# EAGLE design UGVboard (EAGLE 6.2)
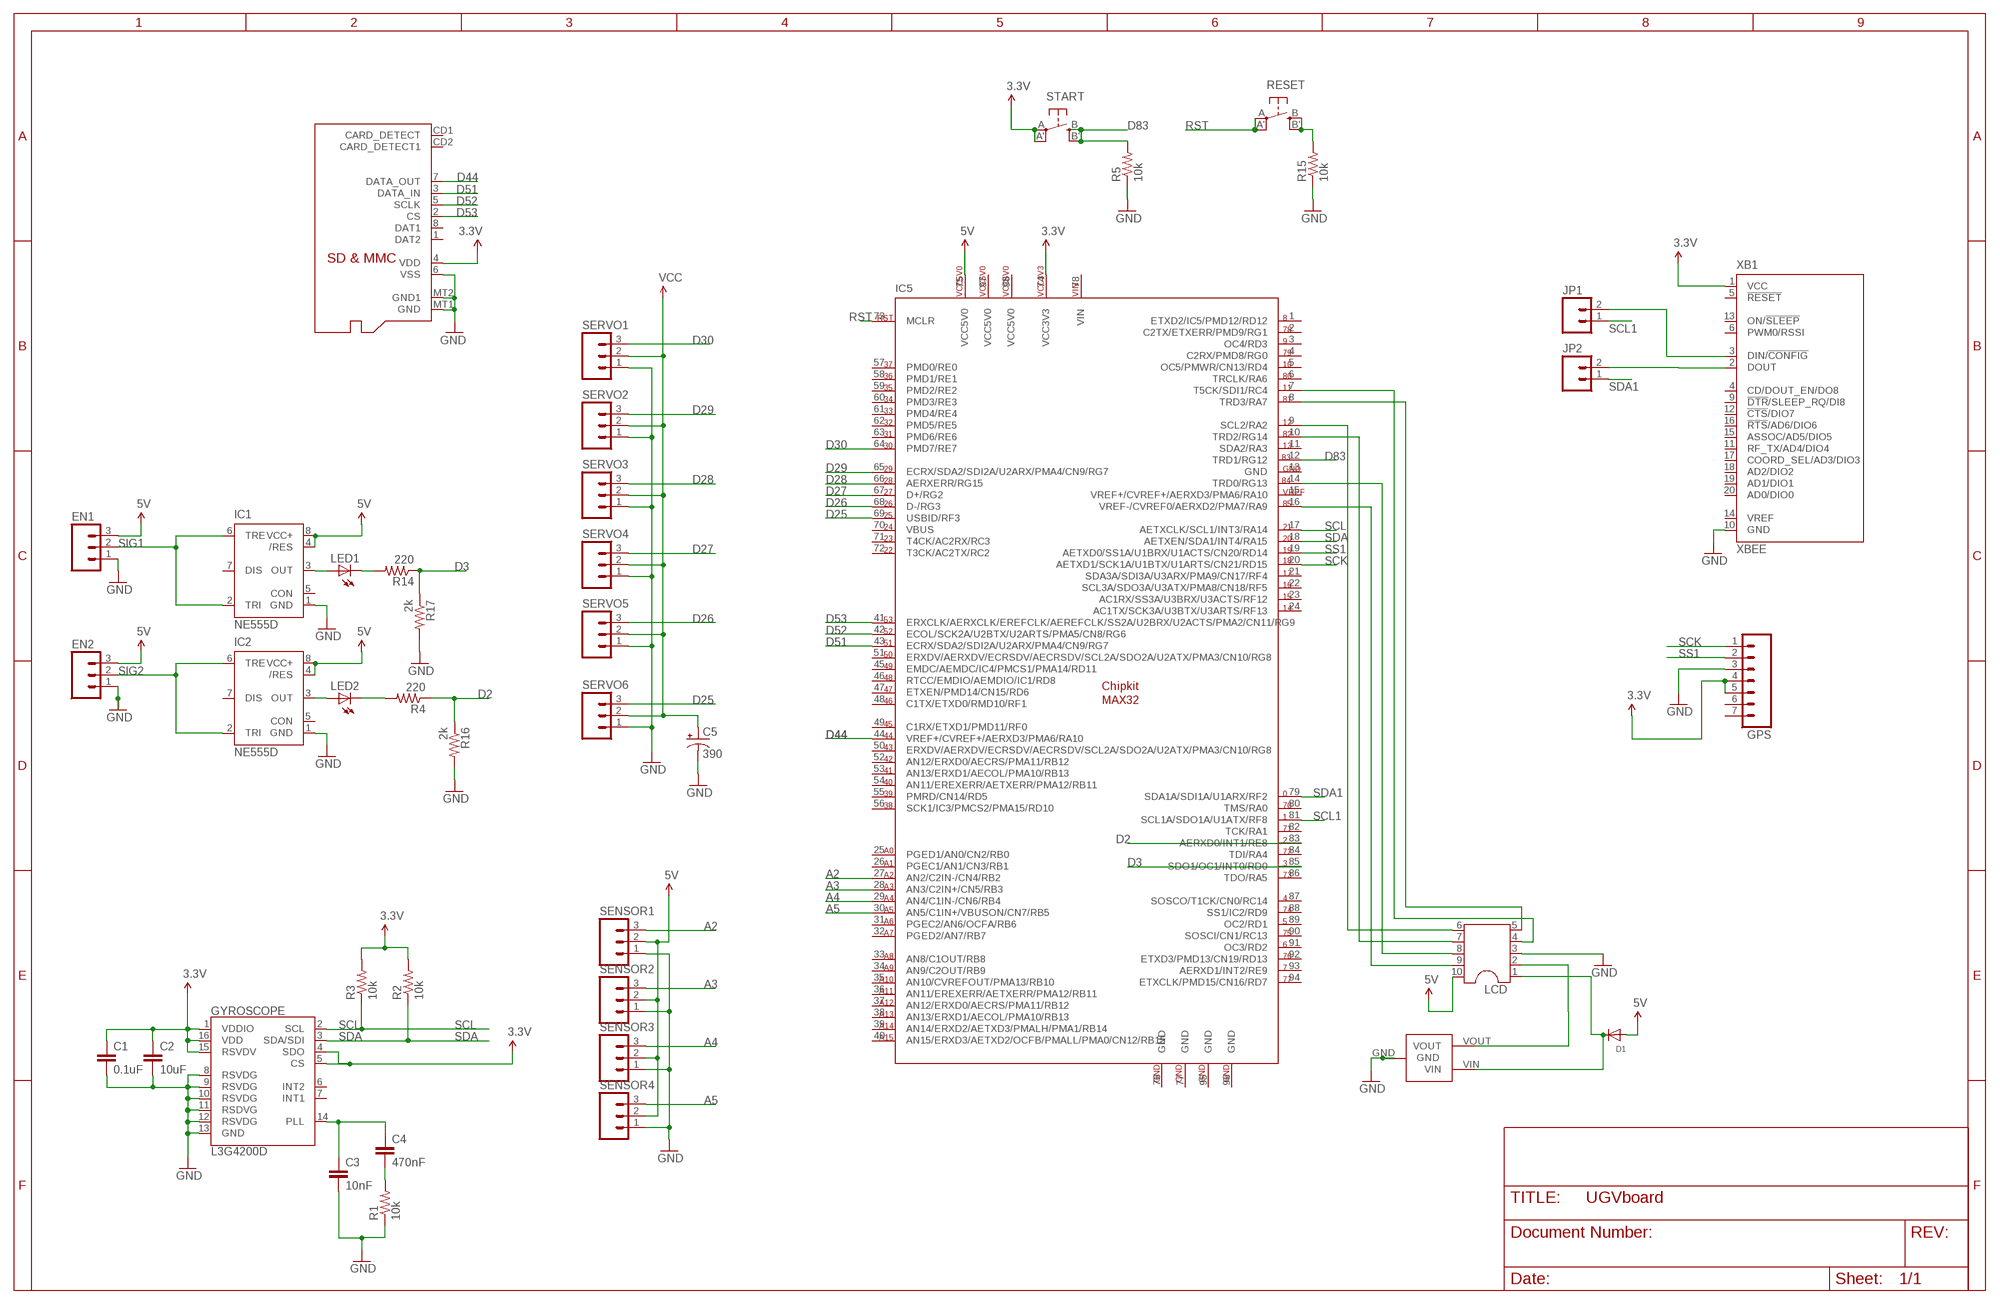
[diagram p0: schematic, sheet 1]

## Parts
C1  0.1uF  CAP0402-CAP  [0402-CAP]
C2  10uF  CAP1206  [1206]
C3  10nF  CAP0402-CAP  [0402-CAP]
C4  470nF  CAP0402-CAP  [0402-CAP]
C5  390  CPOL-USE3.5-8  [E3,5-8]
D1  DIODESOD-323F  [SOD-323F]
EN1  M031X03_NO_SILK  [1X03_NO_SILK]
EN2  M031X03_NO_SILK  [1X03_NO_SILK]
GPS  M07  [1X07]
GYROSCOPE  L3G4200D  [LGA16-4X4]
IC1  NE555D  [SO08]
IC2  NE555D  [SO08]
IC5  CHIPKIT_MAX_CONNECT  [CHIPKIT_MAX32_CONNECT]
JP1  M02PTH  [1X02]
JP2  M02PTH  [1X02]
LCD  DIL10  [DIL10]
LED1  LED0603  [LED-0603]
LED2  LED0603  [LED-0603]
POT  POT2  [POT2]
R1  10k  RESISTOR0402-RES  [0402-RES]
R2  10k  RESISTOR0402-RES  [0402-RES]
R3  10k  RESISTOR0402-RES  [0402-RES]
R4  220  RESISTOR0402-RES  [0402-RES]
R5  10k  RESISTOR0402-RES  [0402-RES]
R14  220  RESISTOR0402-RES  [0402-RES]
R15  10k  RESISTOR0402-RES  [0402-RES]
R16  2k  RESISTOR0402-RES  [0402-RES]
R17  2k  RESISTOR0402-RES  [0402-RES]
RESET  SPST_TACT-EVQQ2  [EVQ-Q2]
SDCARD  MICROSD  [MICROSD]
SENSOR1  M03PTH  [1X03]
SENSOR2  M03PTH  [1X03]
SENSOR3  M03PTH  [1X03]
SENSOR4  M03PTH  [1X03]
SERVO1  M031X03_NO_SILK  [1X03_NO_SILK]
SERVO2  M031X03_NO_SILK  [1X03_NO_SILK]
SERVO3  M031X03_NO_SILK  [1X03_NO_SILK]
SERVO4  M031X03_NO_SILK  [1X03_NO_SILK]
SERVO5  M031X03_NO_SILK  [1X03_NO_SILK]
SERVO6  M031X03_NO_SILK  [1X03_NO_SILK]
START  Start  SPST_TACT-EVQQ2  [EVQ-Q2]
XB1  XBEE  [XBEE]

## Nets
3.3V: C1.1 C2.1 GPS.4 GPS.5 GYROSCOPE.1(VDDIO) GYROSCOPE.4(SDO) GYROSCOPE.5(CS) GYROSCOPE.15(RSVDV) GYROSCOPE.16(VDD) IC5.74(VCC3V3) R2.2 R3.2 START.A'(P1) START.A(P) XB1.1(VCC)
5V: D1.A EN1.3 EN2.3 IC1.4(/RES) IC1.8(VCC+) IC2.4(/RES) IC2.8(VCC+) IC5.75(VCC5V0) LCD.10 SENSOR1.2 SENSOR2.2 SENSOR3.2 SENSOR4.2
A2: IC5.27(AN2/C2IN-/CN4/RB2) SENSOR1.3
A3: IC5.28(AN3/C2IN+/CN5/RB3) SENSOR2.3
A4: IC5.29(AN4/C1IN-/CN6/RB4) SENSOR3.3
A5: IC5.30(AN5/C1IN+/VBUSON/CN7/RB5) SENSOR4.3
D2: IC5.83(AERXD0/INT1/RE8) R4.1 R16.1
D3: IC5.85(SDO1/OC1/INT0/RD0) R14.1 R17.1
D25: IC5.69(USBID/RF3) SERVO6.3
D26: IC5.68(D-/RG3) SERVO5.3
D27: IC5.67(D+/RG2) SERVO4.3
D28: IC5.66(AERXERR/RG15) SERVO3.3
D29: IC5.65(ECRX/SDA2/SDI2A/U2ARX/PMA4/CN9/RG7) SERVO2.3
D30: IC5.64(PMD7/RE7) SERVO1.3
D44: IC5.44(VREF+/CVREF+/AERXD3/PMA6/RA10) SDCARD.7(DATA_OUT)
D51: IC5.43(ECRX/SDA2/SDI2A/U2ARX/PMA4/CN9/RG7) SDCARD.3(DATA_IN)
D52: IC5.42(ECOL/SCK2A/U2BTX/U2ARTS/PMA5/CN8/RG6) SDCARD.5(SCLK)
D53: IC5.41(ERXCLK/AERXCLK/EREFCLK/AEREFCLK/SS2A/U2BRX/U2ACTS/PMA2/CN11/RG9) SDCARD.2(CS)
D83: IC5.12(TRD1/RG12) R5.2 START.B'(S1) START.B(S)
GND: C1.2 C2.2 C3.2 C5.- EN1.1 EN2.1 GPS.3 GYROSCOPE.8(RSVDG) GYROSCOPE.9(RSVDG) GYROSCOPE.10(RSVDG) GYROSCOPE.11(RSDVG) GYROSCOPE.12(RSVDG) GYROSCOPE.13(GND) IC1.1(GND) IC2.1(GND) LCD.3 POT.GND R1.1 R5.1 R15.1 R16.2 R17.2 SDCARD.6(VSS) SDCARD.MT1(GND) SDCARD.MT2(GND1) SENSOR1.1 SENSOR2.1 SENSOR3.1 SENSOR4.1 SERVO1.1 SERVO2.1 SERVO3.1 SERVO4.1 SERVO5.1 SERVO6.1 XB1.10(GND)
N$15: IC5.14(TRD0/RG13) LCD.8
N$16: IC5.7(T5CK/SDI1/RC4) LCD.4
N$17: IC5.16(VREF-/CVREF0/AERXD2/PMA7/RA9) LCD.9
N$18: IC1.3(OUT) LED1.A
N$19: LED1.C R14.2
N$20: LED2.C R4.2
N$21: IC2.3(OUT) LED2.A
N$22: JP1.2 XB1.3(DIN/!CONFIG)
N$23: JP2.2 XB1.2(DOUT)
N$25: IC5.9(SCL2/RA2) LCD.6
N$26: IC5.10(TRD2/RG14) LCD.7
N$27: D1.C LCD.1 POT.VIN
N$28: LCD.2 POT.VOUT
N$29: IC5.8(TRD3/RA7) LCD.5
N$40: R15.2 RESET.B'(S1) RESET.B(S)
PLL: C3.1 C4.1 GYROSCOPE.14(PLL)
PLL-2: C4.2 R1.2
RST: IC5.73(MCLR) RESET.A'(P1) RESET.A(P)
SCK: GPS.1 IC5.20(AETXD1/SCK1A/U1BTX/U1ARTS/CN21/RD15)
SCL: GYROSCOPE.2(SCL) IC5.17(AETXCLK/SCL1/INT3/RA14) R3.1
SCL1: IC5.81(SCL1A/SDO1A/U1ATX/RF8) JP1.1
SDA: GYROSCOPE.3(SDA/SDI) IC5.18(AETXEN/SDA1/INT4/RA15) R2.1
SDA1: IC5.79(SDA1A/SDI1A/U1ARX/RF2) JP2.1
SIG1: EN1.2 IC1.2(TRI) IC1.6(TRE)
SIG2: EN2.2 IC2.2(TRI) IC2.6(TRE)
SS1: GPS.2 IC5.19(AETXD0/SS1A/U1BRX/U1ACTS/CN20/RD14)
VCC: C5.+ SERVO1.2 SERVO2.2 SERVO3.2 SERVO4.2 SERVO5.2 SERVO6.2
VDD: SDCARD.4(VDD) ; supply symbol labelled 3.3V
Unconnected: GPS.6 GPS.7 GYROSCOPE.6(INT2) GYROSCOPE.7(INT1) IC1.5(CON) IC1.7(DIS) IC2.5(CON) IC2.7(DIS) IC5.1(ETXD2/IC5/PMD12/RD12) IC5.2(C2TX/ETXERR/PMD9/RG1) IC5.3(OC4/RD3) IC5.4(C2RX/PMD8/RG0) IC5.5(OC5/PMWR/CN13/RD4) IC5.6(TRCLK/RA6) IC5.11(SDA2/RA3) IC5.13(GND) IC5.15(VREF+/CVREF+/AERXD3/PMA6/RA10) IC5.21(SDA3A/SDI3A/U3ARX/PMA9/CN17/RF4) IC5.22(SCL3A/SDO3A/U3ATX/PMA8/CN18/RF5) IC5.23(AC1RX/SS3A/U3BRX/U3ACTS/RF12) IC5.24(AC1TX/SCK3A/U3BTX/U3ARTS/RF13) IC5.25(PGED1/AN0/CN2/RB0) IC5.26(PGEC1/AN1/CN3/RB1) IC5.31(PGEC2/AN6/OCFA/RB6) IC5.32(PGED2/AN7/RB7) IC5.33(AN8/C1OUT/RB8) IC5.34(AN9/C2OUT/RB9) IC5.35(AN10/CVREFOUT/PMA13/RB10) IC5.36(AN11/EREXERR/AETXERR/PMA12/RB11) IC5.37(AN12/ERXD0/AECRS/PMA11/RB12) IC5.38(AN13/ERXD1/AECOL/PMA10/RB13) IC5.39(AN14/ERXD2/AETXD3/PMALH/PMA1/RB14) IC5.40(AN15/ERXD3/AETXD2/OCFB/PMALL/PMA0/CN12/RB15) IC5.45(EMDC/AEMDC/IC4/PMCS1/PMA14/RD11) IC5.46(RTCC/EMDIO/AEMDIO/IC1/RD8) IC5.47(ETXEN/PMD14/CN15/RD6) IC5.48(C1TX/ETXD0/RMD10/RF1) IC5.49(C1RX/ETXD1/PMD11/RF0) IC5.50(ERXDV/AERXDV/ECRSDV/AECRSDV/SCL2A/SDO2A/U2ATX/PMA3/CN10/RG8) IC5.51(ERXDV/AERXDV/ECRSDV/AECRSDV/SCL2A/SDO2A/U2ATX/PMA3/CN10/RG8) IC5.52(AN12/ERXD0/AECRS/PMA11/RB12) IC5.53(AN13/ERXD1/AECOL/PMA10/RB13) IC5.54(AN11/EREXERR/AETXERR/PMA12/RB11) IC5.55(PMRD/CN14/RD5) IC5.56(SCK1/IC3/PMCS2/PMA15/RD10) IC5.57(PMD0/RE0) IC5.58(PMD1/RE1) IC5.59(PMD2/RE2) IC5.60(PMD3/RE3) IC5.61(PMD4/RE4) IC5.62(PMD5/RE5) IC5.63(PMD6/RE6) IC5.70(VBUS) IC5.71(T4CK/AC2RX/RC3) IC5.72(T3CK/AC2TX/RC2) IC5.80(TMS/RA0) IC5.82(TCK/RA1) IC5.84(TDI/RA4) IC5.86(TDO/RA5) IC5.87(SOSCO/T1CK/CN0/RC14) IC5.88(SS1/IC2/RD9) IC5.89(OC2/RD1) IC5.90(SOSCI/CN1/RC13) IC5.91(OC3/RD2) IC5.92(ETXD3/PMD13/CN19/RD13) IC5.93(AERXD1/INT2/RE9) IC5.94(ETXCLK/PMD15/CN16/RD7) SDCARD.1(DAT2) SDCARD.8(DAT1) SDCARD.CD1(CARD_DETECT) SDCARD.CD2(CARD_DETECT1) XB1.4(CD/DOUT_EN/DO8) XB1.5(!RESET) XB1.6(PWM0/RSSI) XB1.9(!DTR!/SLEEP_RQ/DI8) XB1.11(RF_TX/AD4/DIO4) XB1.12(!CTS!/DIO7) XB1.13(ON/!SLEEP) XB1.14(VREF) XB1.15(ASSOC/AD5/DIO5) XB1.16(!RTS!/AD6/DIO6) XB1.17(COORD_SEL/AD3/DIO3) XB1.18(AD2/DIO2) XB1.19(AD1/DIO1) XB1.20(AD0/DIO0)

## Power pins joined to a net without a drawn wire
GND: IC5.76(GND) IC5.77(GND) IC5.95(GND) IC5.96(GND)
VCC5V0: IC5.97(VCC5V0) IC5.98(VCC5V0)
VIN: IC5.78(VIN)

## Library data of the parts
C1-C4 = SparkFun:CAP: Capacitor Standard 0603 ceramic capacitor, and 0.1" leaded capacitor.
C5 = rcl:CPOL-US: POLARIZED CAPACITOR, American symbol
D1 = adafruit:DIODE: Diode SMADIODE - SMA Surface Mount Package 20V 1A Schottky Diode Digikey: 641-1014-6-ND DO-1N4148 - Through Hole Small Current Diode SOD-123 20V 1 A (.5mV Vf) Schottky Diode - Digikey: MBRX120TPMSCT-ND SOD-323 10V 570mA (.38mV Vf, 3ns) Schottky Diode - Digikey: ZLLS410CT-ND SOD-523 30V 30mA Schottky Diode (RB751S-40TE61) - Digikey: RB751S-40TE61CT-ND SOT23-R/W - SOT23 Package (R = Solder Paste/Reflow Ovens, W = Hand-Soldering) BAT54Film 40V 300mA - Digikey: 497-7162-1-ND
EN1 EN2 SENSOR1-SENSOR4 SERVO1-SERVO6 = SparkFun:M03: Header 3 Standard 3-pin 0.1" header. Use with straight break away headers (SKU : PRT-00116), right angle break away headers (PRT-00553), swiss pins (PRT-00743), machine pins (PRT-00117), and female headers (PRT-00115). Molex polarized connector foot print use with SKU : PRT-08232 with associated crimp pins and housings.
GPS = SparkFun:M07: Header 7 Standard 7-pin 0.1" header. Use with straight break away headers (SKU : PRT-00116), right angle break away headers (PRT-00553), swiss pins (PRT-00743), machine pins (PRT-00117), and female headers (PRT-00115). NOTES ON THE VARIANTS LOCK and LOCK_LONGPADS... This footprint was designed to help hold the alignment of a through-hole component (i.e. 7-pin header) while soldering it into place. You may notice that each hole has been shifted either up or down by 0.005 of an inch from it's more standard position (which is usually a perfectly straight line). This slight alteration caused the pins (the squares in the middle) to touch the edges of the holes. Because they are alternating, it causes a "brace" to hold the header in place. 0.005 has proven to be the perfect amount of "off-center" position when using our standard breakaway headers. Although looks a little odd when you look at the bare footprint, once you have a header in there, the alteration is very hard to notice. Also, if you push a header all the way into place, it is covered up entirely on the bottom side. This idea of altering the position of holes to aid alignment will be further integrated into the Sparkfun Library for other footprints. It can help hold any component with 3 or more connection pins.
GYROSCOPE = SparkFun:L3G4200D: L3G4200D Three-axis, digital output gyroscope The L3G4200D is a low-power three-axis angular rate sensor, has a full scale of ±250/±500/±2000 dps and is capable of measuring rates with a user-selectable bandwidth. It includes a sensing element and an IC interface capable of providing the measured angular rate to the external world through a digital interface (I2C/SPI). Package: 4x4x1.1 LGA-16 (LGA16-4x4.PAC)
IC1 IC2 = SparkFun:NE555: General purpose bipolar Timer
IC5 = chipkit:CHIPKIT_MAX_CONNECT: The chipKIT? Max32? is based on the popular Arduino? open source hardware prototyping platform but adds the performance of the Microchip PIC32 microcontroller. The Max32 is the same form factor as the Arduino Mega board and is compatible with many Arduino? shields as well as larger shields for use with the Mega boards. It features a USB serial port interface for connection to the IDE and can be powered via USB or an external power supply. The Max32 board takes advantage of the powerful PIC32MX795F512 microcontroller. This microcontroller features a 32-bit MIPS processor core running at 80Mhz, 512K of flash program memory and 128K of SRAM data memory. In addition, the processor provides a USB 2 OTG controller, 10/100 Ethernet MAC and dual CAN controllers that can be accessed via add-on I/O shields. The Max32 can be programmed using an environment based on the original Arduino? IDE modified to support PIC32. In addition, the Max32 is fully compatible with the advanced Microchip MPLAB® IDE and the PICKit3 in-system programmer/debugger. For additional platform-specific support for your chipKIT, please visit: http://www.chipkit.org/forum/.
JP1 JP2 = SparkFun:M02: Header 2 Standard 2-pin 0.1" header. Use with straight break away headers (SKU : PRT-00116), right angle break away headers (PRT-00553), swiss pins (PRT-00743), machine pins (PRT-00117), and female headers (PRT-00115). Molex polarized connector foot print use with SKU : PRT-08233 with associated crimp pins and housings.
LCD = ic-package:DIL10: Dual In Line / Socket
LED1 LED2 = SparkFun:LED: LEDs Standard schematic elements and footprints for 5mm, 3mm, 1206, and 0603 sized LEDs. 5mm - Spark Fun Electronics SKU : COM-00529 (and others)
POT = smdpot:POT2
R1-R5 R14-R17 = SparkFun:RESISTOR: Resistor Basic schematic elements and footprints for 0603, 1206, and PTH resistors.
RESET START = adafruit:SPST_TACT: SMT 6mm switch, EVQQ2 series http://www.ladyada.net/library/eagle
SDCARD = adafruit:MICROSD: Micro-SD / Transflash card holder with SPI pinout For the 3M # 2908-05WB-MG and/or 4UCON #19656 push-push type
XB1 = maxstream:XBEE: XBee (TM) /XBee-PRO(TM) OEM RF Modules Source: MaxStream, Inc. xbee_productmanual.pdf; MPN: XBP24-Z7UIT-004; OC_FARNELL: 1751799; OC_NEWARK: 34R5507

## Board
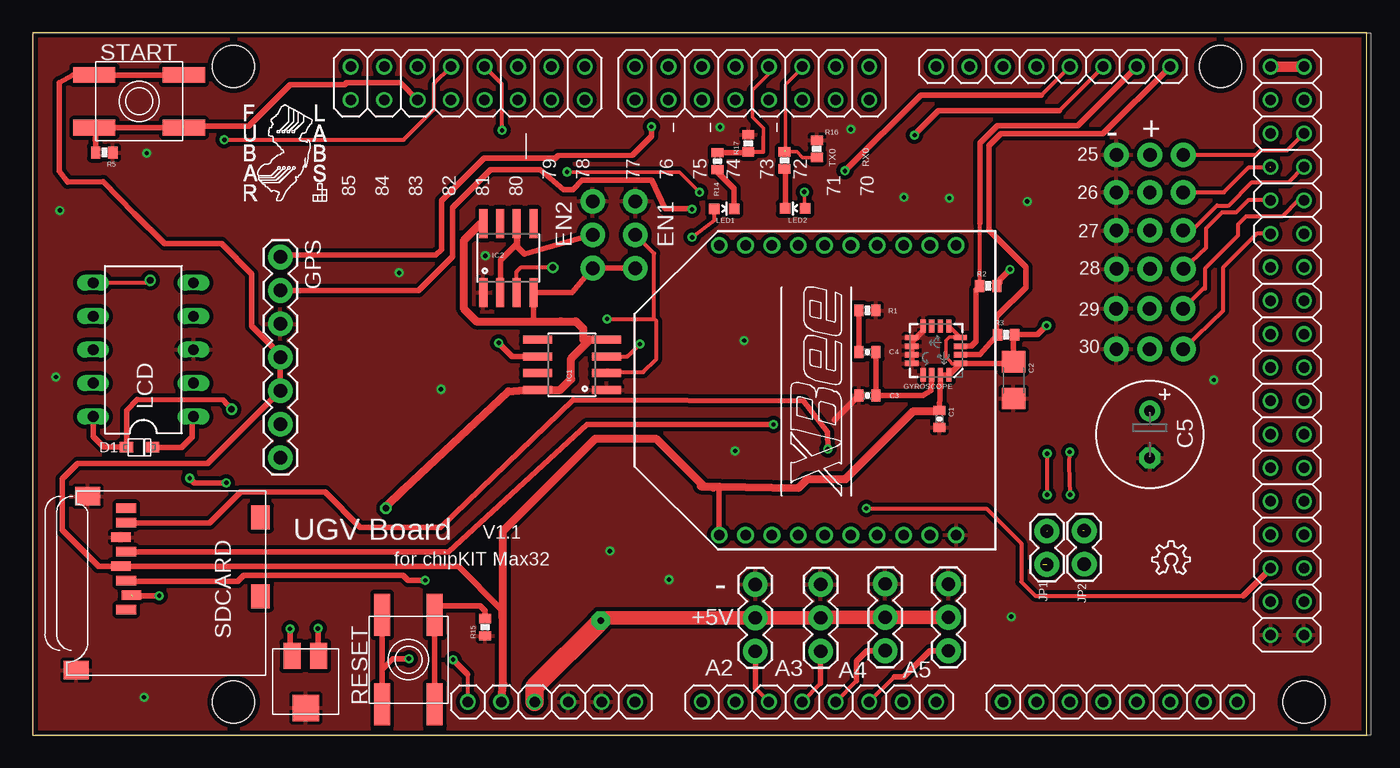
[diagram p1: board, top side]
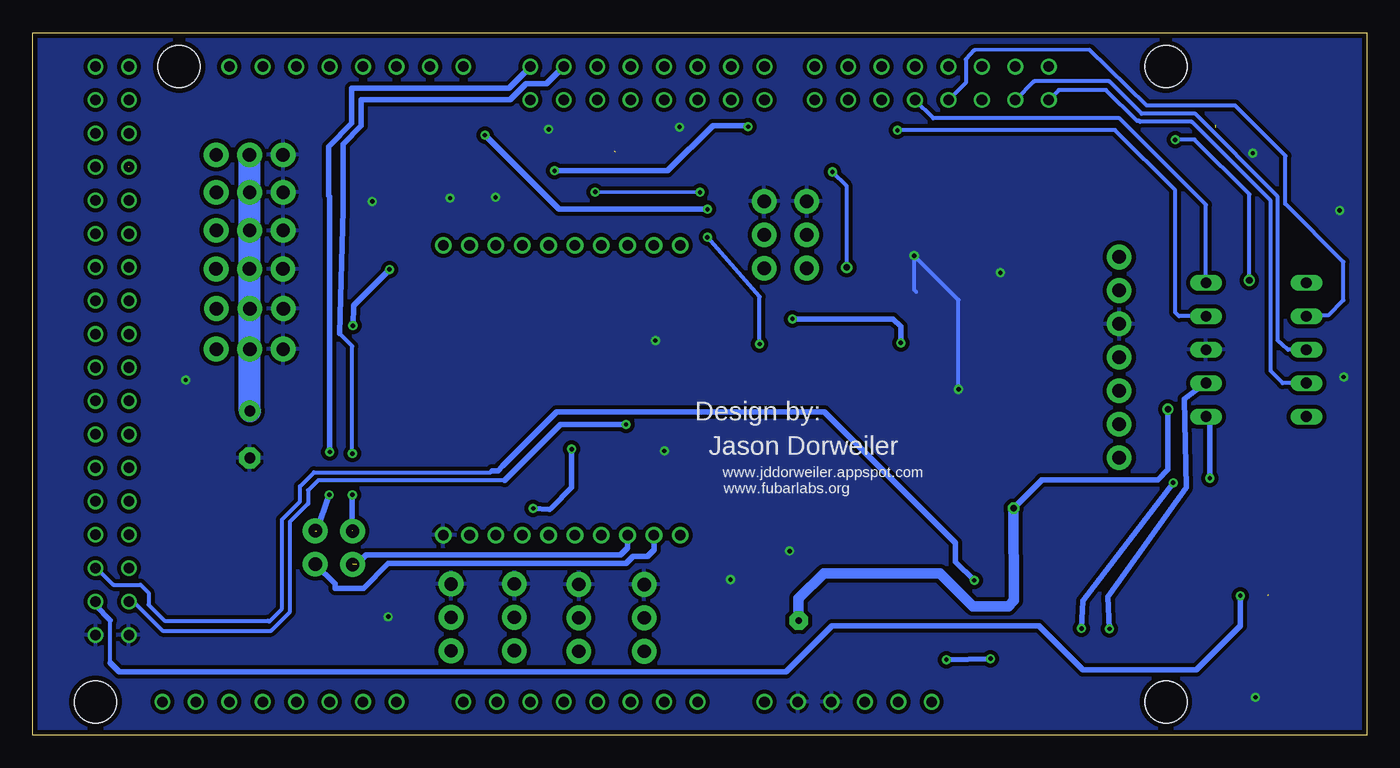
[diagram p2: board, bottom side, seen from below]

Size 101.27 x 53.33 mm. Coordinates in mm from the lower left corner, seen from the top.
Outline: 0,0 101.27,0 101.27,53.33 0,53.33 0,0
Copper layers (1*16): Top 0.0356mm / dielectric 1.5011mm / Bottom 0.0356mm
Design rules: minimum track width 6mil, minimum drill 13mil, track to track 6mil, track to pad 6mil, pad to pad 6mil, via to via 6mil, smd to smd 6mil, copper to edge 15mil, drill to drill 6mil, minimum pad ring 7mil, minimum via ring 7mil, stop-mask expansion 4mil, vias tented up to drill 0mil, thermal gap 10mil

### Footprints (pad centres in the part's own frame; a part is rotated, then mirrored left to right if it is on the bottom)
0402-CAP = smd 0.7 x 0.9: 1 -0.65,0; 2 0.65,0
1206 = smd 1.6 x 1.8: 1 -1.4,0; 2 1.4,0
E3,5-8 = drill 0.813 pad 1.6: + -1.778,0 | drill 0.813 pad 1.6 octagon: - 1.778,0
SOD-323F = smd 1 x 0.8: A -1,0; C 1,0
1X03_NO_SILK = drill 1.016 pad 1.88: 1 0,0; 2 2.54,0; 3 5.08,0
1X07 = drill 1.016 pad 1.88: 1 0,0; 2 2.54,0; 3 5.08,0; 4 7.62,0; 5 10.16,0; 6 12.7,0; 7 15.24,0
LGA16-4X4 = smd 1 x 0.4: 1 -1.85,0.975; 2 -1.85,0.325; 3 -1.85,-0.325; 4 -1.85,-0.975; 9 1.85,-0.975; 10 1.85,-0.325; 11 1.85,0.325; 12 1.85,0.975 | smd 0.4 x 1: 5 -0.975,-1.85; 6 -0.325,-1.85; 7 0.325,-1.85; 8 0.975,-1.85; 13 0.975,1.85; 14 0.325,1.85; 15 -0.325,1.85; 16 -0.975,1.85
SO08 = smd 0.61 x 2.21: 1 -1.905,-2.616; 2 -0.635,-2.616; 3 0.635,-2.616; 4 1.905,-2.616; 5 1.905,2.616; 6 0.635,2.616; 7 -0.635,2.616; 8 -1.905,2.616
CHIPKIT_MAX32_CONNECT = drill 0.8: 1 41.91,50.8; 2 41.91,48.26; 3 39.37,50.8; 4 39.37,48.26; 5 36.83,50.8; 6 36.83,48.26; 7 34.29,50.8; 8 34.29,48.26; 9 31.75,50.8; 10 31.75,48.26; 11 29.21,50.8; 12 29.21,48.26; 13 26.67,50.8; 14 26.67,48.26; 15 24.13,50.8; 16 24.13,48.26; 17 86.36,50.8; 18 83.82,50.8; 19 81.28,50.8; 20 78.74,50.8; 21 76.2,50.8; 22 73.66,50.8; 23 71.12,50.8; 24 68.58,50.8; 25 50.8,2.54; 26 53.34,2.54; 27 55.88,2.54; 28 58.42,2.54; 29 60.96,2.54; 30 63.5,2.54; 31 66.04,2.54; 32 68.58,2.54; 33 73.66,2.54; 34 76.2,2.54; 35 78.74,2.54; 36 81.28,2.54; 37 83.82,2.54; 38 86.36,2.54; 39 88.9,2.54; 40 91.44,2.54; 41 96.52,10.16; 42 93.98,10.16; 43 96.52,12.7; 44 93.98,12.7; 45 96.52,15.24; 46 93.98,15.24; 47 96.52,17.78; 48 93.98,17.78; 49 96.52,20.32; 50 93.98,20.32; 51 96.52,22.86; 52 93.98,22.86; 53 96.52,25.4; 54 93.98,25.4; 55 96.52,27.94; 56 93.98,27.94; 57 96.52,30.48; 58 93.98,30.48; 59 96.52,33.02; 60 93.98,33.02; 61 96.52,35.56; 62 93.98,35.56; 63 96.52,38.1; 64 93.98,38.1; 65 96.52,40.64; 66 93.98,40.64; 67 96.52,43.18; 68 93.98,43.18; 69 96.52,45.72; 70 93.98,45.72; 71 96.52,48.26; 72 93.98,48.26; 73 33.02,2.54; 74 35.56,2.54; 75 38.1,2.54; 76 40.64,2.54; 77 43.18,2.54; 78 45.72,2.54; 79 63.5,50.8; 80 63.5,48.26; 81 60.96,50.8; 82 60.96,48.26; 83 58.42,50.8; 84 58.42,48.26; 85 55.88,50.8; 86 55.88,48.26; 87 53.34,50.8; 88 53.34,48.26; 89 50.8,50.8; 90 50.8,48.26; 91 48.26,50.8; 92 48.26,48.26; 93 45.72,50.8; 94 45.72,48.26; 95 96.52,7.62; 96 93.98,7.62; 97 96.52,50.8; 98 93.98,50.8 | hole 3.2: 15.24,50.8; 15.24,2.54; 90.17,50.8; 96.52,2.54
1X02 = drill 1.016 pad 1.88: 1 0,0; 2 2.54,0
DIL10 = drill 0.813 long: 1 -5.08,-3.81; 2 -2.54,-3.81; 3 0,-3.81; 4 2.54,-3.81; 5 5.08,-3.81; 6 5.08,3.81; 7 2.54,3.81; 8 0,3.81; 9 -2.54,3.81; 10 -5.08,3.81
LED-0603 = smd 0.8 x 0.8: A 0,-0.75; C 0,0.75
POT2 = smd 2 x 2: GND 0,2 | smd 1.3 x 2: VIN -0.96,-1.96; VOUT 1.04,-1.96
0402-RES = smd 0.7 x 0.9: 1 -0.65,0; 2 0.65,0
EVQ-Q2 = smd 3.2 x 1.2: A -3.4,-2; A' 3.4,-2; B -3.4,2; B' 3.4,2
MICROSD = smd 0.7 x 1.5: 1 9,-10.64; 2 7.9,-10.24; 3 6.8,-10.64; 4 5.7,-11.04; 5 4.6,-10.64; 6 3.5,-11.04; 7 2.4,-10.64; 8 1.3,-10.64 | smd 1.8 x 1.4: CD1 2,-0.44; CD2 8,-0.44 | smd 1.4 x 1.9: MT1 0.4,-13.54; MT2 13.6,-14.44
1X03 = drill 1.016 pad 1.88: 1 0,0; 2 2.54,0; 3 5.08,0
XBEE = drill 0.8 pad 1.27: 1 -11,9; 2 -11,7; 3 -11,5; 4 -11,3; 5 -11,1; 6 -11,-1; 7 -11,-3; 8 -11,-5; 9 -11,-7; 10 -11,-9; 11 11,-9; 12 11,-7; 13 11,-5; 14 11,-3; 15 11,-1; 16 11,1; 17 11,3; 18 11,5; 19 11,7; 20 11,9

### Placement (x,y rotation side)
C1  68.83,24 270 top
C2  74.46,26.95 270 top
C3  63.37,25.78 180 top
C4  63.37,29.08 180 top
C5  84.8,22.83 270 top
D1  8.1,21.86 0 top
EN1  45.75,40.54 270 top
EN2  42.51,40.54 270 top
GPS  18.78,36.31 270 top
GYROSCOPE  68.58,29.21 180 top
IC1  40.93,28.12 90 top
IC2  36.11,36.23 0 top
IC5  0,-0.03 0 top
JP1  77,15.49 270 top
JP2  79.83,15.51 270 top
LCD  8.38,29.27 90 top
LED1  52.49,39.98 270 top
LED2  57.88,40 90 top
POT  20.72,4.06 180 top
R1  63.37,32.26 180 top
R2  72.54,34.11 0 top
R3  73.9,30.4 0 top
R4  57.07,43.64 270 top
R5  5.42,44.25 180 top
R14  51.98,43.59 270 top
R15  34.33,8.19 90 top
R16  59.52,44.52 90 top
R17  54.32,44.95 90 top
RESET  28.51,5.73 270 top
SDCARD  17.72,18.53 270 top
SENSOR1  54.85,11.44 270 top
SENSOR2  59.82,11.44 270 top
SENSOR3  64.71,11.48 270 top
SENSOR4  69.52,11.47 270 top
SERVO1  82.27,29.31 0 top
SERVO2  82.26,32.38 0 top
SERVO3  82.28,35.4 0 top
SERVO4  82.27,38.33 0 top
SERVO5  82.27,41.23 0 top
SERVO6  82.28,44.07 0 top
START  8.06,48.13 180 top
U$8  [OSHW_6X100_NOTEXT]  85.01,12.2 0 top
U$10  [FUBARLOGO3]  15.99,40.53 0 top
XB1  61.11,26.19 90 top

### Tracks (layer width: path | path; a pad name or v marks a point on that pad's centre or on a via)
3.3V  (via drill 0.33)
  Top 0.254: 70.34,30.22 69.58,30.22 69.33,29.97 69.33,28.95 69.33,28.7 69.58,28.44 69.84,28.19 70.38,28.19 GYROSCOPE.1
  Top 0.305: GYROSCOPE.5 GYROSCOPE.4 70.38,30.19 70.34,30.22
  Top 0.406: C1.1 68.45,24.51 | C1.1 GYROSCOPE.15 GYROSCOPE.16 GYROSCOPE.1 74.35,28.24 C2.1 74.46,30.31 R3.2 76.29,30.4 v76.97,31.09 | R2.2 73.43,34.35 73.43,34.61 v74.19,35.37 | C1.1 68.81,24.68 | 35.71,3.86 35.56,9.56 32.32,12.8 6.7,12.8 4.98,12.8 4.98,12.83 2.22,15.58 2.21,15.58 2.21,19.25 2.21,19.44 3.4,20.64 13.27,20.64 GPS.5 GPS.4 18.78,28.89 16.62,31.05 16.62,35.03 14.34,37.31 9.99,37.31 7.7,39.61 5.32,42.05 2.65,42.01 1.98,42.84 1.98,49.54 3.04,50.13 START.A' START.A | 51.69,18.67 50.87,18.95 50.77,18.98 | XB1.1 52.11,18.86
  Top 0.61: IC5.74 35.71,3.86 35.71,15.52 42.71,22.52 47.3,22.52 50.87,18.95 | 50.77,18.98 50.72,18.89 52.11,18.86 58.14,18.77 58.81,19.44 61.71,19.44 66.88,24.61 68.79,24.61 C1.1
  Bottom 0.406: v76.97,31.09 76.94,32.61 v74.19,35.37
5V  (via drill 0.5, 0.5 pad 1.42)
  Top 0.406: v26.81,17.22 26.8,17.2 28.18,18.68 | LCD.10 4.57,22.7 5.37,21.89 7.06,21.89 D1.A 7.1,24.65 7.92,25.49 14.46,25.45 v15.09,24.74 | 40.08,31.42 38.01,31.42 IC2.4 40.94,33.62 EN2.3 EN1.3
  Top 0.61: 34.15,38.85 IC2.8 34.01,38.85 32.7,37.54 32.7,32.4 33.68,31.42 40.08,31.42 41.23,31.42 41.8,30.85 41.8,30.02 42.3,30.02 | 26.76,17.28 28.18,18.68 36.08,26.1 37.34,26.21 IC1.8 40.04,26.21 40.87,27.04 40.87,28.59 42.3,30.02 | 42.3,30.02 IC1.4
  Top 0.813: 43.08,8.69 v43.13,8.69
  Top 1.016: SENSOR4.2 SENSOR3.2 59.82,8.94 SENSOR2.2 SENSOR1.2 43.13,8.9 v43.13,8.69
  Top 1.422: IC5.75 38.1,3.66 v43.13,8.69
  Bottom 0.406: v15.09,24.74 15.09,20.17 15.86,19.39 24.69,19.39 24.69,19.34 v26.81,17.22
  Bottom 0.813: v43.13,8.69 43.13,10.36 41.2,12.29 32.4,12.29 29.88,9.78 27.22,9.78 26.77,10.22 v26.81,17.22
A2
  Top 0.305: 54.85,3.55 IC5.27
  Top 0.406: SENSOR1.3 54.85,3.55
A3
  Top 0.305: 59.82,3.91 IC5.28
  Top 0.406: SENSOR2.3 59.82,3.91
A4
  Top 0.305: 62.55,4.1 IC5.29
  Top 0.406: SENSOR3.3 63.34,6.4 62.55,5.61 62.55,4.1
A5
  Top 0.305: 65.41,4.42 IC5.30
  Top 0.406: SENSOR4.3 68.13,6.39 66.16,4.42 65.41,4.42
D2  (1 unrouted)
  Top 0.254: R4.1 58.02,44.29 58.45,43.87 R16.1 | IC5.83 58.42,50.68 57.15,49.41 57.15,44.37
D3
  Top 0.254: R17.1 54.27,44.24 | IC5.85 55.88,50.25 54.62,48.99 54.62,46.93 55.46,46.09 55.46,45.44
  Top 0.305: R17.1 55.46,44.3 55.46,45.44
  Top 0.406: R14.1 54.27,44.24
D25
  Top 0.305: SERVO6.3 92.91,44.07 93.26,44.42 95.24,44.42 IC5.69
D26  (1 unrouted)
  Top 0.305: SERVO5.3 90.45,41.23 92.34,43.12 93.95,43.12
D27
  Top 0.305: IC5.67 95.34,41.98 92.57,41.98 90.82,40.23 89.9,40.23 88,38.33 SERVO4.3
D28
  Top 0.305: SERVO3.3 89.06,37 89.06,38.47 90.28,39.69 91.35,39.69 92.27,40.61 IC5.66
D29
  Top 0.305: IC5.65 96.08,40.61 94.86,39.39 92.11,39.39 91.5,38.78 91.5,37.94 88.99,35.43 88.99,34.03 | 88.99,34.03 88.99,33.91 | SERVO2.3 88.99,34.03
D30
  Top 0.305: SERVO1.3 90.36,32.22 90.36,35.5 92.93,38.07 IC5.64
D44  (via drill 0.33)
  Top 0.305: v63.28,17.21 72.38,17.21 75.04,14.55 75.04,11.65 76.11,10.59 91.89,10.59
  Top 0.406: SDCARD.7 13.44,16.13 15.76,18.45 22.19,18.45 24.85,15.79 30.96,15.79 41.01,25.45 58.51,25.38 60.34,23.03 v60.36,21.72 | 91.89,10.59 IC5.44
  Bottom 0.406: v60.36,21.72 60.36,18.8 61.9,17.23 62.05,17.15 v63.28,17.21
D51  (via drill 0.33)  (1 unrouted)
  Top 0.254: 7.72,11.68 7.67,11.73
  Top 0.406: SDCARD.3 7.67,11.73 | 7.72,11.68 15.56,11.68 15.99,12.11 28.1,12.11 28.49,11.73 29.77,11.73 v29.79,11.75
  Bottom 0.305: 96.49,12.67 96.41,12.67 95.16,11.42 93.1,11.42 92.49,10.81 92.49,9.9 91.27,8.68 83.43,8.68 83.35,8.6 82.36,9.59 82.36,16.38 80.99,17.75 80.99,18.89 79.92,19.96 66.53,19.96 66.42,20.07
  Bottom 0.406: v29.79,11.75 31.2,13.16 31.2,14.58 41.15,24.52 61.51,24.52 65.6,20.43 65.96,20.07 66.42,20.07
D52  (via drill 0.33)
  Top 0.406: v56.24,23.58 42.09,23.58 31.56,13.89 7.08,13.89 SDCARD.5
  Bottom 0.305: 65.44,19.35 79.61,19.35 80.38,18.59 80.38,17.6 | 80.38,17.6 80.38,17.52 | IC5.42 93.64,10.13 91.43,7.92 83.2,7.92 81.75,9.37 81.75,16.22 80.38,17.6
  Bottom 0.406: v56.24,23.58 61.21,23.58 65.44,19.35
D53  (via drill 0.33)  (1 unrouted)
  Top 0.406: v9.59,10.59 7.52,10.59
  Bottom 0.305: 95.4,5.47 95.4,8.73
  Bottom 0.406: 95.4,5.47 94.72,4.79 44.09,4.79 40.6,8.28 24.89,8.28 21.55,4.95 13.02,4.95 12.94,4.95 9.59,8.3 v9.59,10.59 | 95.4,8.73 96.52,9.84 IC5.41
D83  (1 unrouted)
  Top 0.406: IC5.12 27.9,49.54 23.81,49.54 23.69,49.42 19.55,49.42 16.37,46.24 12.37,46.24 12.37,46.33 11.46,46.33 | 4.74,45.35 4.75,44.83 | 4.75,44.83 R5.2 | START.B START.B' 4.75,46.13 4.75,44.83
GND  (via drill 0.33)
  Top 0.305: 67.6,30.71 GYROSCOPE.8
  Top 0.406: 60.85,23.91 C3.2 | GYROSCOPE.9 66.84,30.07 66.97,30.07 | 66.97,30.07 66.73,29.83 GYROSCOPE.10 GYROSCOPE.11 GYROSCOPE.12 | 66.97,30.07 67.6,30.71
  Bottom 0.305: v30.99,26.26 30.99,33.05 v34.35,36.42 34.35,33.83 34.2,33.67
  other vias: 8.64,44.2 43.81,13.97 69.6,40.78 66.14,40.84 54,29.96 53.33,21.58 62.11,46 52.17,46.18 75.5,40.53 89.67,26.97 74.28,8.98 1.74,27.2 2.04,39.85 48.3,11.8 8.43,2.87 27.8,35.12
  pour Top (isolate 0.305): -0.09,-0.09 101.3,-0.09 101.3,53.35 0.13,53.35 0,53.48
  pour Bottom (isolate 0.305): 0.04,53.4 -0.22,53.4 -0.22,-0.76 102.51,-0.76 102.51,53.73 0.04,53.35
N$15
  Bottom 0.305: LCD.8 5.98,29.27 6.76,29.97 6.76,40.88 12.99,47.19 17.07,47.19 19.53,49.66 25.25,49.66 IC5.14
N$16  (via drill 0.33)
  Top 0.305: v35.62,45.94 35.62,49.44 IC5.7
  Bottom 0.305: LCD.4 14.25,31.81 14.53,32.09 14.53,41.38 19.1,45.95 35.61,45.95 v35.62,45.94
N$17
  Bottom 0.305: LCD.9 6.36,26.73 7.29,27.66 7.29,40.59 13.28,46.58 17.18,46.58 17.25,46.65 17.44,46.65 19.79,49 23.37,49 IC5.16
N$18  (via drill 0.33)
  Top 0.305: IC1.3 45.14,28.75 v46.08,29.7 | v50.06,37.81 51.75,39.11 LED1.A
  Bottom 0.305: v46.08,29.7 46.08,33.29 v50.06,37.81
N$19
  Top 0.406: R14.2 51.98,42.75 53.25,41.48 53.25,39.99 LED1.C
N$20
  Top 0.406: LED2.C 57.13,42.94 R4.2
N$21  (via drill 0.33, 0.5)
  Top 0.254: v40.56,42.77 49.1,42.77 50.62,41.25 v50.62,41.22 | v58.57,41.25 58.57,40.05 LED2.A
  Top 0.305: IC2.3 36.74,35.19 37.08,35.53 39.45,35.53 v39.47,35.51
  Bottom 0.254: v50.62,41.22 58.54,41.22 v58.57,41.25
  Bottom 0.305: v39.47,35.51 39.47,41.68 v40.56,42.77
N$22  (1 unrouted)
  Bottom 0.406: XB1.3 56.11,14.22 56.64,13.69 75.97,13.69 76.71,12.95
N$23
  Bottom 0.406: XB1.2 54.11,14.06 54.6,13.58 55.69,13.58 56.22,13.04 74.28,13.04 76.17,11.15 78.33,11.15 78.33,11.47 JP2.2
N$25  (via drill 0.33, 0.5)
  Top 0.305: LCD.6 8.71,34.35 v8.9,34.54 | v14.53,45.21 28.16,45.21 30.47,47.52 30.47,49.49 IC5.9
  Bottom 0.305: v8.9,34.54 8.9,41.07 13.07,45.24 14.5,45.24 v14.53,45.21
N$26
  Bottom 0.305: LCD.7 4.57,31.9 2.87,31.9 1.75,33.02 1.75,35.93 6.18,40.36 6.18,43.98 6.16,44.01 9.97,47.82 16.7,47.82 21.04,52.04 29.81,52.01 30.44,51.32 30.44,49.54 IC5.10
N$27  (via drill 0.33)
  Top 0.406: D1.C 11.29,21.86 12.08,22.64 12.08,24.08 LCD.1 | v14.68,19.16 12.24,19.16 v11.9,19.51 | v21.65,8.09 21.65,5.98 POT.VIN
  Bottom 0.406: v21.65,8.09 21.53,10.21 v14.68,19.16 | v11.9,19.51 11.9,23.9 LCD.1
N$28  (via drill 0.33)
  Top 0.406: v19.52,8.06 19.52,6.09 POT.VOUT
  Bottom 0.406: v19.52,8.06 19.63,10.48 13.68,18.82 13.86,25.54 LCD.2
N$29
  Bottom 0.305: LCD.5 12.19,40.27 18.76,46.84 32.89,46.84 IC5.8
N$40
  Top 0.406: R15.2 34.33,9.43 33.95,9.82 30.54,9.82 30.51,9.79 RESET.B | RESET.B | RESET.B RESET.B'
PLL
  Top 0.406: C4.1 C3.1 67.56,25.78 68.2,26.16 GYROSCOPE.14
PLL-2
  Top 0.406: C4.2 R1.2
RST  (via drill 0.33, 0.33 pad 0.25)
  Top 0.305: 33.02,4.61 IC5.73
  Top 0.406: 33.02,4.61 v31.9,5.73 | v28.55,5.8 27.33,5.78 26.5,4.95 26.5,2.34 RESET.A' RESET.A
  Bottom 0.406: v31.9,5.73 v28.55,5.8
SCK  (via drill 0.33)
  Top 0.305: 76.58,48.62 IC5.20
  Top 0.406: 76.58,48.62 68.34,48.62 67.41,48.62 v61.66,42.86 | GPS.1 18.78,36.44 19.85,36.44 30.59,36.44 31.04,36.88 31.04,40.58 34.26,43.8 39.62,43.8 39.65,43.78 39.89,44.02 45.52,44.03 46.97,45.48 v46.97,46.21
  Bottom 0.406: v61.66,42.86 53.07,42.86 49.64,46.28 47.04,46.28 v46.97,46.21
SCL
  Top 0.305: R3.1 73.25,31.85
  Top 0.406: IC5.17 81.25,45.67 73.51,45.67 72.61,44.77 72.61,40.3 72.61,38.34 75.4,35.55 75.4,34 73.25,31.85 | GYROSCOPE.2 71.92,28.89 R3.1
SCL1  (via drill 0.33)  (1 unrouted)
  Top 0.305: v77.01,18.25 v77.01,21.37
  Bottom 0.305: v77.01,21.37 77.01,29.54 77.97,30.49
  Bottom 0.406: 77,18.24 v77.01,18.25 77.01,15.49 | IC5.81 62.27,49.47 63.82,49.47 64.92,48.36 65.04,48.25 76.34,48.25 76.34,46.27 77.72,44.88 77.72,39.89 77.97,30.49
SDA
  Top 0.305: R2.1 71.89,38.87
  Top 0.406: 71.89,38.87 71.89,44.96 73.23,46.29 79.34,46.29 IC5.18 | GYROSCOPE.3 71.25,29.54 71.6,29.88 71.6,33.82 R2.1
SDA1  (via drill 0.33)  (1 unrouted)
  Top 0.305: v78.77,18.25 78.68,20.54 v78.73,21.5
  Bottom 0.305: 78.73,40.89 78.8,40.97
  Bottom 0.406: 78.8,40.97 78.8,44.7 77.05,46.46 77.05,49.15 65.56,49.15 65.13,49.15 IC5.79 | v78.73,21.5 78.73,40.89 | 79.74,15.51 v78.77,18.25
SIG1  (via drill 0.33)
  Top 0.305: v43.6,31.61 47.17,31.61 | 43.62,27.56 46.33,27.56 47.34,28.57 47.34,31.43 47.35,31.43 47.17,31.61 | 47.17,31.61 47.17,36.58 EN1.2
  Top 0.406: IC1.6 36.4,28.75 v35.37,29.78
  Top 0.61: 43.62,27.56 IC1.2
  Bottom 0.406: v35.37,29.78 35.37,31.01 35.97,31.61 v43.6,31.61
SIG2
  Top 0.406: EN2.2 37.34,36.51 36.79,37.06 36.79,38.8 IC2.6 36.74,37.3 35.51,36.07 35.51,33.66 IC2.2
SS1  (via drill 0.33)
  Top 0.305: 77.94,47.43 IC5.19
  Top 0.406: 77.94,47.43 68.77,47.43 66.94,45.61 v66.94,45.57 | GPS.2 29.27,33.77 31.85,36.35 31.85,40.06 34.75,42.95 38.49,42.95 38.52,42.93 40.28,41.44 41,41.44 41.71,42.15 46.96,42.15 47.01,42.1 48.01,39.97 50.01,39.97 v50.05,39.93
  Bottom 0.406: v50.05,39.93 61.31,39.93 v66.94,45.57
VCC
  Bottom 1.676: C5.+ SERVO1.2 84.8,29.31 SERVO2.2 84.82,32.38 SERVO3.2 SERVO4.2 SERVO5.2 84.82,41.23 SERVO6.2
VCC5V0
  Top 0.813: IC5.98 IC5.97

### Text on the board
tPlace: - | + | 25 | 26 | 27 | 28 | 29 | 30 | UGV Board | V1.1 | for chipKIT Max32 | - | +5V | A2 | A3 | A4 | A5
bPlace: Design by: | Jason Dorweiler | www.jddorweiler.appspot.com | www.fubarlabs.org